# Altium schematic sheet DRV8701EVM_SCHEMATIC.SchDoc
size 431 x 279 mm; Date: Not shown in title block; ApprovedBy: Not shown in title block; CheckedBy: Not shown in title block; Author: Not shown in title block; CompanyName: Not shown in title block; Engineer: Not shown in title block; Organization: Not shown in title block; Address1: Not shown in title block; Address2: Not shown in title block; Address3: Not shown in title block; Address4: Not shown in title block; DocumentNumber: 1; Revision: Use project parameter SCH_Rev; SheetNumber: 2; SheetTotal: 2; PageSetup: Record=PageOptions|CenterHorizontal=True|CenterVertical=True|PrintScale=0.62|XCorrection=1.00|YCorrection=1.00|PrintKind=0|BorderSize=5000000|LeftOffset=0|BottomOffset=0|Orientation=2|PaperLength=1000|PaperWidth=1000|Scale=100|PaperSource=15|PrintQuality=600|MediaType=1|DitherType=10|PaperKind=Letter|PrintScaleMode=1; CurrentTime: Not shown in title block; CurrentDate: Not shown in title block; Time: Not shown in title block; DocumentFullPathAndName: Not shown in title block; DocumentName: Not shown in title block; ModifiedDate: Not shown in title block; ImagePath: Not shown in title block
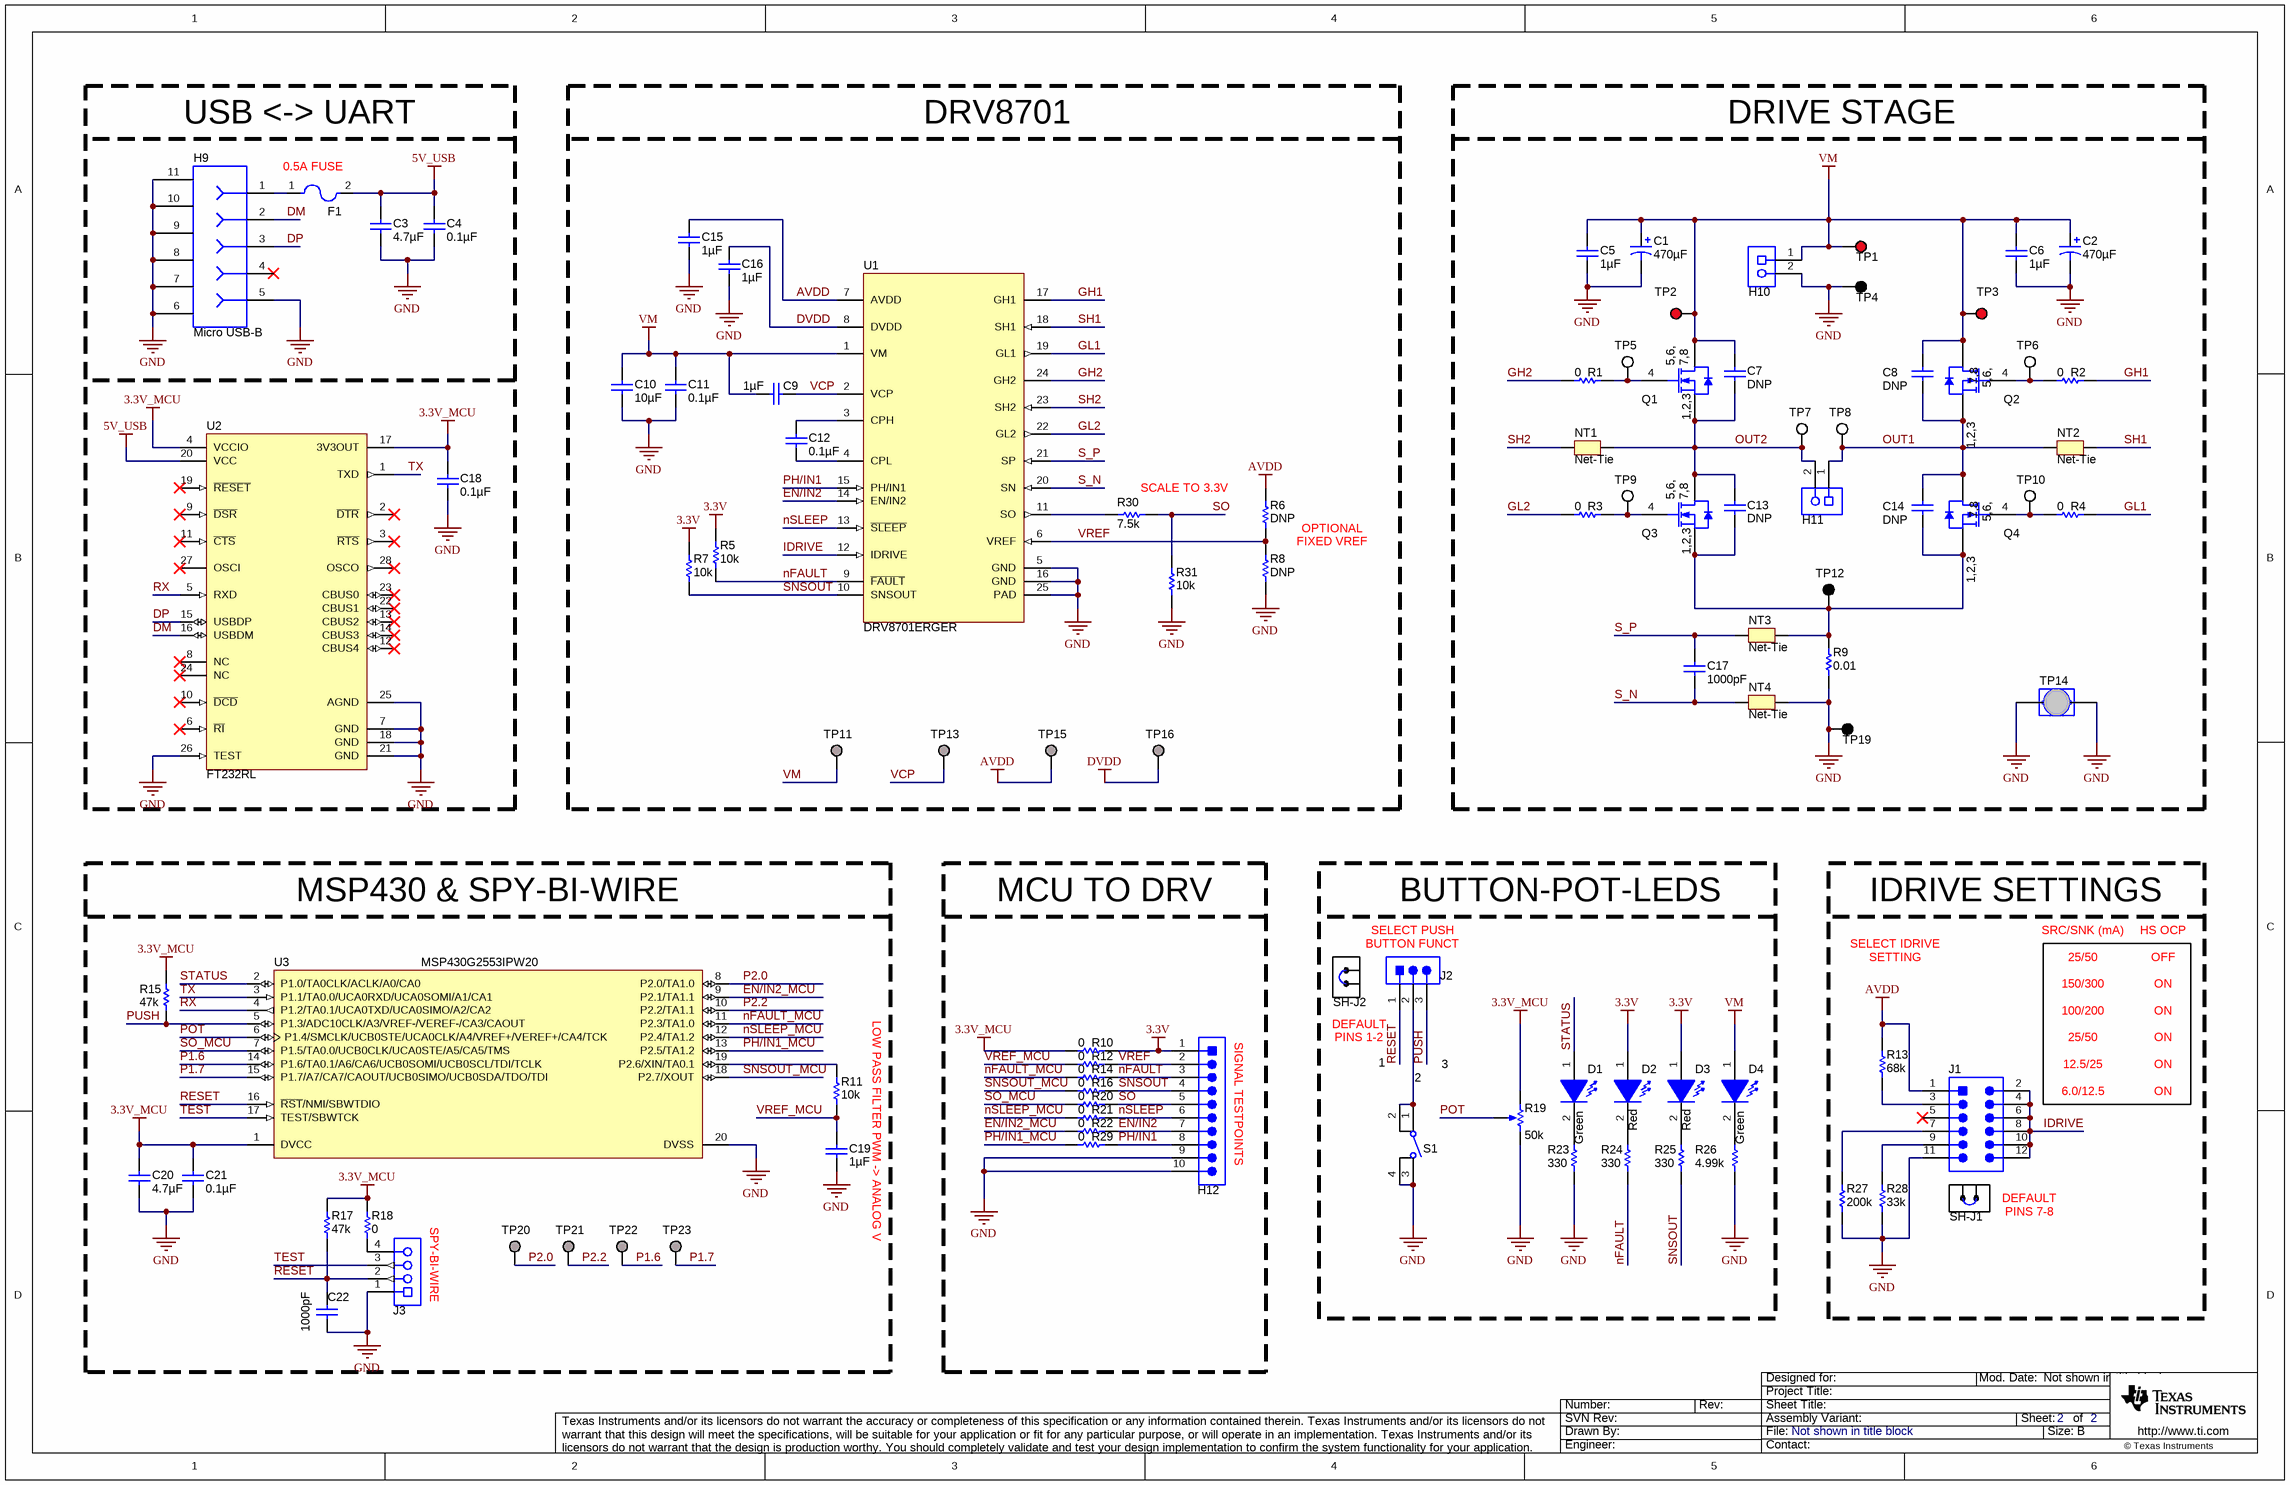
[diagram p0: DRV8701EVM_SCHEMATIC.SchDoc]

## Parts
C1  ValueDisplayed: 470µF  [M_1000x2000]  (hidden comment: ECA-1HM471)
C2  ValueDisplayed: 470µF  [M_1000x2000]  (hidden comment: ECA-1HM471)
C3  ValueDisplayed: 4.7µF  [0805L]  (hidden comment: C2012X7R1A475M)
C4  ValueDisplayed: 0.1µF  [0603L]  (hidden comment: C0603C104K8RACTU)
C5  ValueDisplayed: 1µF  [0805L]  (hidden comment: GRM21BR71H105KA12L)
C6  ValueDisplayed: 1µF  [0805L]  (hidden comment: GRM21BR71H105KA12L)
C7  DNP  [0603L]
C8  DNP  [0603L]
C9  ValueDisplayed: 1µF  [0603L]  (hidden comment: C1608X7R1C105K)
C10  ValueDisplayed: 10µF  [1210L]  (hidden comment: GRM32ER71H106KA12L)
C11  ValueDisplayed: 0.1µF  [0603L]  (hidden comment: C1608X7R1H104K)
C12  ValueDisplayed: 0.1µF  [0603L]  (hidden comment: C1608X7R1H104K)
C13  DNP  [0603L]
C14  DNP  [0603L]
C15  ValueDisplayed: 1µF  [0603L]  (hidden comment: GRM188R70J105KA01D)
C16  ValueDisplayed: 1µF  [0603L]  (hidden comment: GRM188R70J105KA01D)
C17  ValueDisplayed: 1000pF  [0402L]  (hidden comment: GRM155R71C102KA01D)
C18  ValueDisplayed: 0.1µF  [0603L]  (hidden comment: C0603C104K8RACTU)
C19  ValueDisplayed: 1µF  [0603L]  (hidden comment: GRM188R70J105KA01D)
C20  ValueDisplayed: 4.7µF  [0805L]  (hidden comment: C2012X7R1A475M)
C21  ValueDisplayed: 0.1µF  [0603L]  (hidden comment: C0603C104K8RACTU)
C22  ValueDisplayed: 1000pF  [0603L]  (hidden comment: GRM188R71C102KA01D)
D1  value Green  [LED_LTST-C171]  (hidden comment: LTST-C171GKT)
D2  value Red  [LED_LTST-C170]  (hidden comment: LTST-C170KRKT)
D3  value Red  [LED_LTST-C170]  (hidden comment: LTST-C170KRKT)
D4  value Green  [LED_LTST-C171]  (hidden comment: LTST-C171GKT)
F1  1206L050/15YR  [1206_FUSE]  (value not drawn)
H9  PackageReference: Micro USB-B  [CONN_USB_micro_ZX62-B-5PA]  (hidden comment: ZX62-B-5PA(11))
H10  691 101 710 002  [Wurth_691101710002]  (value not drawn)
H11  691 101 710 002  [Wurth_691101710002]  (value not drawn)
H12  TSW-110-07-G-S  [TSW-110-07-G-S]  (value not drawn)
J1  PEC06DAAN  [CONN_PEC06DAAN]  (value not drawn)
J2  PEC03SAAN  [CONN_PEC03SAAN]  (value not drawn)
J3  851-43-004-20-001000  [CONN_851-43-004-20-001000]  (value not drawn)
NT1  Net-Tie  [Net-Tie_10mil]  (net tie, no BOM)
NT2  Net-Tie  [Net-Tie_10mil]  (net tie, no BOM)
NT3  Net-Tie  [Net-Tie_10mil]  (net tie, no BOM)
NT4  Net-Tie  [Net-Tie_10mil]  (net tie, no BOM)
Q1  CSD18532Q5B  [TRANS_NexFET_Q5B]  (value not drawn)
Q2  CSD18532Q5B  [TRANS_NexFET_Q5B]  (value not drawn)
Q3  CSD18532Q5B  [TRANS_NexFET_Q5B]  (value not drawn)
Q4  CSD18532Q5B  [TRANS_NexFET_Q5B]  (value not drawn)
R1  value 0  [0603L]  (hidden comment: CRCW06030000Z0EA)
R2  value 0  [0603L]  (hidden comment: CRCW06030000Z0EA)
R3  value 0  [0603L]  (hidden comment: CRCW06030000Z0EA)
R4  value 0  [0603L]  (hidden comment: CRCW06030000Z0EA)
R5  value 10k  [0603L]  (hidden comment: CRCW060310K0JNEA)
R6  DNP  [0603L]
R7  value 10k  [0603L]  (hidden comment: CRCW060310K0JNEA)
R8  DNP  [0603L]
R9  value 0.01  [2512M]  (hidden comment: CRA2512-FZ-R010ELF)
R10  value 0  [0603L]  (hidden comment: CRCW06030000Z0EA)
R11  value 10k  [0603L]  (hidden comment: CRCW060310K0JNEA)
R12  value 0  [0603L]  (hidden comment: CRCW06030000Z0EA)
R13  value 68k  [0603L]  (hidden comment: CRCW060368K0JNEA)
R14  value 0  [0603L]  (hidden comment: CRCW06030000Z0EA)
R15  value 47k  [0603L]  (hidden comment: CRCW060347K0JNEA)
R16  value 0  [0603L]  (hidden comment: CRCW06030000Z0EA)
R17  value 47k  [0603L]  (hidden comment: CRCW060347K0JNEA)
R18  value 0  [0603L]  (hidden comment: CRCW06030000Z0EA)
R19  value 50k  [Bourns_3352T]  (hidden comment: 3352T-1-503LF)
R20  value 0  [0603L]  (hidden comment: CRCW06030000Z0EA)
R21  value 0  [0603L]  (hidden comment: CRCW06030000Z0EA)
R22  value 0  [0603L]  (hidden comment: CRCW06030000Z0EA)
R23  value 330  [0603L]  (hidden comment: CRCW0603330RJNEA)
R24  value 330  [0603L]  (hidden comment: CRCW0603330RJNEA)
R25  value 330  [0603L]  (hidden comment: CRCW0603330RJNEA)
R26  value 4.99k  [0603L]  (hidden comment: CRCW06034K99FKEA)
R27  value 200k  [0603L]  (hidden comment: CRCW0603200KJNEA)
R28  value 33k  [0603L]  (hidden comment: CRCW060333K0JNEA)
R29  value 0  [0603L]  (hidden comment: CRCW06030000Z0EA)
R30  ValueDisplayed: 7.5k  [0603L]  (hidden comment: CRCW06037K50JNEA)
R31  ValueDisplayed: 10k  [0603L]  (hidden comment: CRCW060310K0JNEA)
S1  4-1437565-1  [SW_FSM4JSMA]  (value not drawn)
SH-J1  969102-0000-DA  [SNT-100-BK-G]  (value not drawn)
SH-J2  969102-0000-DA  [SNT-100-BK-G]  (value not drawn)
TP1  5005  [Keystone5005]  (value not drawn)
TP2  5005  [Keystone5005]  (value not drawn)
TP3  5005  [Keystone5005]  (value not drawn)
TP4  5006  [Keystone5006]  (value not drawn)
TP5  5007  [Keystone5007]  (value not drawn)
TP6  5007  [Keystone5007]  (value not drawn)
TP7  5007  [Keystone5007]  (value not drawn)
TP8  5007  [Keystone5007]  (value not drawn)
TP9  5007  [Keystone5007]  (value not drawn)
TP10  5007  [Keystone5007]  (value not drawn)
TP11  VM  [TP_VIA_018RND008]  (value not drawn)  (no BOM)
TP12  5006  [Keystone5006]  (value not drawn)
TP13  VCP  [TP_VIA_018RND008]  (value not drawn)  (no BOM)
TP14  D3082-05  [Harwin_D3082-05]  (value not drawn)
TP15  AVDD  [TP_VIA_018RND008]  (value not drawn)  (no BOM)
TP16  DVDD  [TP_VIA_018RND008]  (value not drawn)  (no BOM)
TP19  5006  [Keystone5006]  (value not drawn)
TP20  TESTPOINT  [TP_VIA_060RND040]  (value not drawn)  (no BOM)
TP21  TESTPOINT  [TP_VIA_060RND040]  (value not drawn)  (no BOM)
TP22  TESTPOINT  [TP_VIA_060RND040]  (value not drawn)  (no BOM)
TP23  TESTPOINT  [TP_VIA_060RND040]  (value not drawn)  (no BOM)
U1  DRV8701ERGER  [RGE0024F]
U2  FT232RL  [SSOP28_N]
U3  MSP430G2553IPW20  [PW0020A_N]

## Blocks framed on the sheet
USB <-> UART: C3 C4 C18 F1 H9 U2
DRV8701: C9-C12 C15 C16 R5-R8 R30 R31 TP11 TP13 TP15 TP16 U1
DRIVE STAGE: C1 C2 C5-C8 C13 C14 C17 H10 H11 NT1-NT4 Q1-Q4 R1-R4 R9 TP1-TP10 TP12 TP14 TP19
MSP430 & SPY-BI-WIRE: C19-C22 J3 R11 R15 R17 R18 TP20-TP23 U3
MCU TO DRV: H12 R10 R12 R14 R16 R20-R22 R29
BUTTON-POT-LEDS: D1-D4 J2 R19 R23-R26 S1 SH-J2
IDRIVE SETTINGS: J1 R13 R27 R28 SH-J1

## Nets
3.3V: D2.1(A) D3.1(A) H12.1 R5.1 R7.1 R10.1
3.3V_MCU: C18.1 C20.1 C21.1 R10.2 R15.2 R17.2 R18.2 R19.1(CCW) U2.4(VCCIO) U2.17(3V3OUT) U3.1(DVCC)
5V_USB: C3.1 C4.1 F1.2 U2.20(VCC)
AVDD: C15.1 J1.1 R6.2 R13.2 TP15.1 U1.7(AVDD)
DVDD: C16.2 TP16.1 U1.8(DVDD)
GND: C1.2(-) C2.2(-) C3.2 C4.2 C5.2 C6.2 C10.2 C11.2 C15.2 C16.1 C18.2 C19.2 C20.2 C21.2 C22.2 H9.5 H9.6 H9.7 H9.8 H9.9 H9.10 H9.11 H10.2 H12.9 H12.10 J1.11 J3.1 NT4.2 R8.1 R9.1 R19.3(CW) R23.1 R26.1 R27.1 R28.1 R31.2 S1.3 S1.4 TP4.1 TP14.1 TP14.2 TP19.1 U1.5(GND) U1.16(GND) U1.25(PAD) U2.7(GND) U2.18(GND) U2.21(GND) U2.25(AGND) U2.26(TEST) U3.20(DVSS)
VM: C1.1(+) C2.1(+) C5.1 C6.1 C7.1 C8.1 C9.2 C10.1 C11.1 D4.1(A) H10.1 Q1.5(D) Q1.6(D) Q1.7(D) Q1.8(D) Q2.5(D) Q2.6(D) Q2.7(D) Q2.8(D) TP1.1 TP2.1 TP3.1 TP11.1 U1.1(VM)
DM: H9.2 U2.16(USBDM)
DP: H9.3 U2.15(USBDP)
EN/IN2: H12.7 R22.1 U1.14(EN/IN2)
EN/IN2_MCU: R22.2 U3.9(P2.1/TA1.1)
GH1: R2.1 U1.17(GH1)
GH2: R1.2 U1.24(GH2)
GL1: R4.1 U1.19(GL1)
GL2: R3.2 U1.22(GL2)
IDRIVE: J1.2 J1.4 J1.6 J1.8 J1.10 J1.12 U1.12(IDRIVE)
nFAULT: H12.3 R5.2 R14.1 R24.1 U1.9(~{FAULT})
nFAULT_MCU: R14.2 U3.11(P2.3/TA1.0)
nSLEEP: H12.6 R21.1 U1.13(~{SLEEP})
nSLEEP_MCU: R21.2 U3.12(P2.4/TA1.2)
OUT1: C8.2 C14.1 H11.1 NT2.2 Q2.1(S) Q2.2(S) Q2.3(S) Q4.5(D) Q4.6(D) Q4.7(D) Q4.8(D) TP8.1
OUT2: C7.2 C13.1 H11.2 NT1.2 Q1.1(S) Q1.2(S) Q1.3(S) Q3.5(D) Q3.6(D) Q3.7(D) Q3.8(D) TP7.1
P1.6: TP22.1 U3.14(P1.6/TA0.1/A6/CA6/UCB0SOMI/UCB0SCL/TDI/TCLK)
P1.7: TP23.1 U3.15(P1.7/A7/CA7/CAOUT/UCB0SIMO/UCB0SDA/TDO/TDI)
P2.0: TP20.1 U3.8(P2.0/TA1.0)
P2.2: TP21.1 U3.10(P2.2/TA1.1)
PH/IN1: H12.8 R29.1 U1.15(PH/IN1)
PH/IN1_MCU: R29.2 U3.13(P2.5/TA1.2)
POT: R19.2(WIPER) U3.6(P1.4/SMCLK/UCB0STE/UCA0CLK/A4/VREF+/VEREF+/CA4/TCK)
PUSH: J2.3 R15.1 U3.5(P1.3/ADC10CLK/A3/VREF-/VEREF-/CA3/CAOUT)
RESET: C22.1 J2.1 J3.2 R17.1 U3.16(~{RST}/NMI/SBWTDIO)
RX: U2.5(RXD) U3.4(P1.2/TA0.1/UCA0TXD/UCA0SIMO/A2/CA2)
S_N: C17.2 NT4.1 U1.20(SN)
S_P: C17.1 NT3.2 U1.21(SP)
SH1: NT2.1 U1.18(SH1)
SH2: NT1.1 U1.23(SH2)
SNSOUT: H12.4 R7.2 R16.1 R25.1 U1.10(SNSOUT)
SNSOUT_MCU: R16.2 U3.18(P2.7/XOUT)
SO: H12.5 R20.1 R30.1 R31.1
SO_MCU: R20.2 U3.7(P1.5/TA0.0/UCB0CLK/UCA0STE/A5/CA5/TMS)
STATUS: D1.1(A) U3.2(P1.0/TA0CLK/ACLK/A0/CA0)
TEST: J3.3 U3.17(TEST/SBWTCK)
TX: U2.1(TXD) U3.3(P1.1/TA0.0/UCA0RXD/UCA0SOMI/A1/CA1)
VCP: C9.1 TP13.1 U1.2(VCP)
VREF: H12.2 R6.1 R8.2 R12.1 U1.6(VREF)
VREF_MCU: C19.1 R11.2 R12.2
NetC12_1: C12.1 U1.3(CPH)
NetC12_2: C12.2 U1.4(CPL)
NetC13_2: C13.2 C14.2 NT3.1 Q3.1(S) Q3.2(S) Q3.3(S) Q4.1(S) Q4.2(S) Q4.3(S) R9.2 TP12.1
NetD1_2: D1.2(K) R23.2
NetD2_2: D2.2(K) R24.2
NetD3_2: D3.2(K) R25.2
NetD4_2: D4.2(K) R26.2
NetF1_1: F1.1 H9.1
NetJ1_3: J1.3 R13.1
NetJ1_7: J1.7 R27.2
NetJ1_9: J1.9 R28.2
NetJ2_2: J2.2 S1.1 S1.2
NetJ3_4: J3.4 R18.1
NetQ1_4: Q1.4(G) R1.1 TP5.1
NetQ2_4: Q2.4(G) R2.2 TP6.1
NetQ3_4: Q3.4(G) R3.1 TP9.1
NetQ4_4: Q4.4(G) R4.2 TP10.1
NetR11_1: R11.1 U3.19(P2.6/XIN/TA0.1)
NetR30_2: R30.2 U1.11(SO)

Not connected (* = marked no-connect by the designer): H9 4*; J1 5*; U2 2(~{DTR})* 3(~{RTS})* 6(~{RI})* 8(NC)* 9(~{DSR})* 10(~{DCD})* 11(~{CTS})* 12(CBUS4)* 13(CBUS2)* 14(CBUS3)* 19(~{RESET})* 22(CBUS1)* 23(CBUS0)* 24(NC)* 27(OSCI)* 28(OSCO)*

## Notes on the sheet
- (near F1) 0.5A FUSE
- (near R30) SCALE TO 3.3V
- OPTIONAL
- FIXED VREF
- SELECT PUSH
- BUTTON FUNCT
- SETTING
- SELECT IDRIVE
- SRC/SNK (mA)
- 25/50
- HS OCP
- OFF
- DEFAULT
- PINS 1-2
- 100/200
- 150/300
- ON
- (near H12) SIGNAL TESTPOINTS
- 1
- (near S1) 2
- 3
- 6.0/12.5
- 12.5/25
- LOW PASS FILTER PWM -> ANALOG V
- PINS 7-8
- (near J3) SPY-BI-WIRE
- Drawn By:
- SVN Rev:
- Number:
- Rev:
- Sheet Title:
- File:
- Project Title:
- Designed for:
- Assembly Variant:
- Mod. Date:
- Sheet:
- Size:
- of
- B
- http://www.ti.com
- Texas Instruments and/or its licensors do not warrant the accuracy or completeness of this specification or any information contained therein. Texas Instruments and/or its licensors do not warrant that this design will meet the specifications, will be suitable for your application or fit for any particular purpose, or will operate in an implementation. Texas Instruments and/or its licensors do not warrant that the design is production worthy. You should completely validate and test your design implementation to confirm the system functionality for your application.
- Engineer:
- Contact:
- © Texas Instruments
- (in symbol CSD18532Q5B) 5,6,; 7,8; 1,2,3

## Library data of the parts
C1 C2 = ECA-1HM471: CAP, AL, 470 µF, 50 V, +/- 20%,  ohm, TH; Manufacturer: Panasonic; Polarized: Y; CompType: Capacitor; Value: 470uF; U/M: EA; Cap_F: 0.00047; Tolerance_%: 20; Value1: Unknown; VDC_V: 50; Value2: 50V; IRMS_A: 0.65; TaMin_C: -40; TaMax_C: 85; Cap_Case: 10x20mm; SymbolVersion: 2008-07-09; PartNumber: ECA-1HM471; PackageReference: D10xL20mm; RoHS: Y; MountType: TH; Technology: AL; Series: M; Publisher: Texas Instruments; LatestRevisionDate: 2015-02-10; ComponentLink1Description: Datasheet link; ComponentLink1URL: http://industrial.panasonic.com/www-data/pdf/ABA0000/ABA0000CE12.pdf; Supplier 1: Digi-Key; Supplier Part Number 1: P5185-ND; Supplier 2: Mouser; Supplier Part Number 2: 667-ECA-1HM471; Supplier 3: Farnell; Supplier Part Number 3: 9693815
C3 C20 = C2012X7R1A475M: CAP, CERM, 4.7uF, 10V, +/-20%, X7R, 0805; Manufacturer: TDK; Polarized: N; CompType: Capacitor; U/M: EA; Cap_F: 0.0000047; Tolerance_%: 20; Value1: Unknown; VDC_V: 10; TaMin_C: -55; TaMax_C: 125; Cap_Case: 0805; SymbolVersion: 2008-07-09; Value: 4.7uF; PartNumber: C2012X7R1A475M; PackageReference: 0805; RoHS: Y; Value2: 10V; MountType: SMT; Technology: Ceramic; TempCo: X7R; Published: 2008-06-19; Publisher: Texas Instruments; LatestRevisionDate: 2014-05-28; ComponentLink1Description: Datasheet link; ComponentLink1URL: http://www.tdk.co.jp/tefe02/e412_c.pdf; Supplier 1: Digi-Key; Supplier Part Number 1: 445-1605-1-ND; Supplier 2: Farnell; Supplier Part Number 2: 1844277
C4 C18 C21 = C0603C104K8RACTU: CAP, CERM, 0.1uF, 10V, +/-10%, X7R, 0603; Manufacturer: Kemet; Polarized: N; CompType: Capacitor; U/M: EA; Cap_F: 0.0000001; Tolerance_%: 10; Value1: Unknown; TaMin_C: -55; TaMax_C: 125; Cap_Case: 0603; SymbolVersion: 2008-07-09; Value: 0.1uF; PartNumber: C0603C104K8RACTU; PackageReference: 0603; RoHS: Y; VDC_V: 10; Value2: 10V; MountType: SMT; Technology: Ceramic; TempCo: X7R; Published: 2008-06-19; Publisher: Texas Instruments; LatestRevisionDate: 2014-05-28; ComponentLink1Description: Datasheet link; ComponentLink1URL: http://www.kemet.com/kemet/web/homepage/kechome.nsf/vapubfiles/F3102_Y5V.pdf/$file/F3102_Y5V.pdf; Supplier 1: Digi-Key; Supplier Part Number 1: 399-1095-1-ND; Supplier 2: Mouser; Supplier Part Number 2: 80-C0603C104K8R; Supplier 3: Farnell; Supplier Part Number 3: 1640032
C5 C6 = GRM21BR71H105KA12L: CAP, CERM, 1uF, 50V, +/-10%, X7R, 0805; Manufacturer: MuRata; Polarized: N; CompType: Capacitor; U/M: EA; Cap_F: 0.000001; Tolerance_%: 10; Value1: Unknown; VDC_V: 50; TaMin_C: -55; TaMax_C: 125; Cap_Case: 0805; SymbolVersion: 2008-07-09; Value: 1uF; PartNumber: GRM21BR71H105KA12L; PackageReference: 0805; RoHS: Y; Value2: 50V; MountType: SMT; Technology: Ceramic; TempCo: X7R; Published: 2008-06-19; Publisher: Texas Instruments; LatestRevisionDate: 2013-09-06; ComponentLink1Description: Datasheet link; ComponentLink1URL: http://search.murata.co.jp/Ceramy/PnsearchViewAction.do?HnOFG=ON&HnNFG=ON&SEL_CNT=50&sLang=en&sKey=GRM21BR71H105KA12L&x=9&y=9&search=startwith; Supplier 1: Digi-Key; Supplier Part Number 1: 490-4736-1-ND; Supplier 2: Mouser; Supplier Part Number 2: 81-GRM21BR71H105KA2L; Supplier 3: Farnell; Supplier Part Number 3: 1735541
C7 C8 C13 C14 = C1608X7R1H103K: CAP, CERM, 0.01uF, 50V, +/-10%, X7R, 0603; Polarized: N; CompType: Capacitor; U/M: EA; Cap_F: 0.00000001; Cap_Case: 0603; SymbolVersion: 2008-07-09; Value: DNP; PartNumber: DNP; ValueDisplayed: DNP; Manufacturer: DNP; PackageReference: 0603; RoHS: Y; MountType: SMT; Technology: Ceramic; Published: 2008-06-19; Publisher: Texas Instruments; LatestRevisionDate: 2014-05-28; ComponentLink1Description: Datasheet link
C9 = C1608X7R1C105K: CAP, CERM, 1uF, 16V, +/-10%, X7R, 0603; Manufacturer: TDK; Polarized: N; CompType: Capacitor; U/M: EA; Cap_F: 0.000001; Tolerance_%: 10; ESR_Ohm: 0.0057; Value1: 0.0057 ohm; VDC_V: 16; TaMin_C: -55; TaMax_C: 125; Cap_Case: 0603; SymbolVersion: 2008-07-09; Value: 1uF; PartNumber: C1608X7R1C105K; PackageReference: 0603; RoHS: Y; Value2: 16V; MountType: SMT; Technology: Ceramic; TempCo: X7R; Published: 2008-06-19; Publisher: Texas Instruments; LatestRevisionDate: 2014-05-28; ComponentLink1Description: Datasheet link; ComponentLink1URL: http://www.tdk.co.jp/tefe02/e412_c.pdf; Supplier 1: Digi-Key; Supplier Part Number 1: 445-1604-1-ND; Supplier 2: Farnell; Supplier Part Number 2: 1907343
C10 = GRM32ER71H106KA12L: CAP, CERM, 10uF, 50V, +/-10%, X7R, 1210; Manufacturer: MuRata; Polarized: N; CompType: Capacitor; U/M: EA; Cap_F: 0.00001; Tolerance_%: 10; Value1: Unknown; VDC_V: 50; TaMin_C: -55; TaMax_C: 125; Cap_Case: 1210; SymbolVersion: 2008-07-09; Value: 10uF; PartNumber: GRM32ER71H106KA12L; PackageReference: 1210; RoHS: Y; Value2: 50V; MountType: SMT; Technology: Ceramic; TempCo: X7R; Published: 2008-06-19; Publisher: Texas Instruments; LatestRevisionDate: 2014-05-28; ComponentLink1Description: Datasheet link; ComponentLink1URL: http://www.murata.com/products/catalog/pdf/c02e.pdf; Supplier 1: Digi-Key; Supplier Part Number 1: 490-6544-1-ND; Supplier 2: Mouser; Supplier Part Number 2: 81-GRM32ER71H106KA2L
C11 C12 = C1608X7R1H104K: CAP, CERM, 0.1uF, 50V, +/-10%, X7R, 0603; Manufacturer: TDK; Polarized: N; CompType: Capacitor; U/M: EA; Cap_F: 0.0000001; Tolerance_%: 10; ESR_Ohm: 0.017; Value1: 0.017 ohm; VDC_V: 50; TaMin_C: -55; TaMax_C: 125; Cap_Case: 0603; SymbolVersion: 2008-07-09; Value: 0.1uF; PartNumber: C1608X7R1H104K; PackageReference: 0603; RoHS: Y; Value2: 50V; MountType: SMT; Technology: Ceramic; TempCo: X7R; Published: 2008-06-19; Publisher: Texas Instruments; LatestRevisionDate: 2014-05-28; ComponentLink1Description: Datasheet link; ComponentLink1URL: http://www.tdk.co.jp/tefe02/e412_c.pdf; Supplier 1: Digi-Key; Supplier Part Number 1: 445-1314-1-ND; Supplier 2: Farnell; Supplier Part Number 2: 1118182
C15 C16 C19 = GRM188R70J105KA01D: CAP, CERM, 1uF, 6.3V, +/-10%, X7R, 0603; Manufacturer: MuRata; Polarized: N; CompType: Capacitor; U/M: EA; Cap_F: 0.000001; Tolerance_%: 10; Value1: Unknown; VDC_V: 6.3; TaMin_C: -55; TaMax_C: 125; Cap_Case: 0603; SymbolVersion: 2008-07-09; Value: 1uF; PartNumber: GRM188R70J105KA01D; PackageReference: 0603; RoHS: Y; Value2: 6.3V; MountType: SMT; Technology: Ceramic; TempCo: X7R; Published: 2008-06-19; Publisher: Texas Instruments; LatestRevisionDate: 2014-05-28; ComponentLink1Description: Datasheet link; ComponentLink1URL: http://search.murata.co.jp/Ceramy/PnsearchViewAction.do?HnOFG=ON&HnNFG=ON&SEL_CNT=50&sLang=en&sKey=GRM188R70J105KA01D&x=9&y=9&search=startwith; Supplier 1: Digi-Key; Supplier Part Number 1: 490-3898-1-ND; Supplier 2: Mouser; Supplier Part Number 2: 81-GRM188R70J105KA01; Supplier 3: Farnell; Supplier Part Number 3: 1845765
C17 = GRM155R71C102KA01D: CAP, CERM, 1000pF, 16V, +/-10%, X7R, 0402; Manufacturer: MuRata; Polarized: N; CompType: Capacitor; U/M: EA; Cap_F: 0.000000001; Tolerance_%: 10; Value1: Unknown; VDC_V: 16; TaMin_C: -55; TaMax_C: 125; Cap_Case: 0402; SymbolVersion: 2008-07-09; Value: 1000pF; PartNumber: GRM155R71C102KA01D; PackageReference: 0402; RoHS: Y; Value2: 16V; MountType: SMT; Technology: Ceramic; TempCo: X7R; Published: 2008-06-19; Publisher: Texas Instruments; LatestRevisionDate: 2013-12-18; ComponentLink1Description: Datasheet link; ComponentLink1URL: http://search.murata.co.jp/Ceramy/PnsearchViewAction.do?HnOFG=ON&HnNFG=ON&SEL_CNT=50&sLang=en&sKey=GRM155R71C102KA01D&x=9&y=9&search=startwith; Supplier 1: Digi-Key; Supplier Part Number 1: GRM155R71C102KA01D-ND; Supplier 2: Mouser; Supplier Part Number 2: 81-GRM155R71C102KA1D
C22 = GRM188R71C102KA01D: CAP, CERM, 1000pF, 16V, +/-10%, X7R, 0603; Manufacturer: MuRata; Polarized: N; CompType: Capacitor; U/M: EA; Cap_F: 0.000000001; Tolerance_%: 10; Value1: Unknown; VDC_V: 16; TaMin_C: -55; TaMax_C: 125; Cap_Case: 0603; SymbolVersion: 2008-07-09; Value: 1000pF; PartNumber: GRM188R71C102KA01D; PackageReference: 0603; RoHS: Y; Value2: 16V; MountType: SMT; Technology: Ceramic; TempCo: X7R; Published: 2008-06-19; Publisher: Texas Instruments; LatestRevisionDate: 2014-05-28; ComponentLink1Description: Datasheet link; ComponentLink1URL: http://search.murata.co.jp/Ceramy/PnsearchViewAction.do?HnOFG=ON&HnNFG=ON&SEL_CNT=50&sLang=en&sKey=GRM188R71C102KA01D&x=9&y=9&search=startwith; Supplier 1: Digi-Key; Supplier Part Number 1: GRM188R71C102KA01D-ND; Supplier 2: Mouser; Supplier Part Number 2: 81-GRM188R71C102KA1D
D1 D4 = LTST-C171GKT: LED, Green, SMD; Manufacturer: Lite-On; Type: AlInGaP; Vf_V: 2.1; Value2: 2.1V; Io_A: 20; Value1: W; U/M: EA; CompType: LED; PartNumber: LTST-C171GKT; SymbolVersion: 2008-12-08; MountType: SMT; RoHS: Y; PackageReference: LED_0805; Color: green; Published: 2008-07-11; Publisher: Texas Instruments; ComponentLink1URL: https://sps06.itg.ti.com/sites/KMS/crossdivteams/altium/docs/ComponentDatasheets/LTST-C171GKT.pdf; ComponentLink1Description: Datasheet link; LatestRevisionDate: 2013-09-07; Supplier 1: Digi-Key; Supplier Part Number 1: 160-1423-1-ND; Supplier 2: Mouser; Supplier Part Number 2: 859-LTST-C171GKT
D2 D3 = LTST-C170KRKT: LED, Red, SMD; Manufacturer: Lite-On; Type: AlInGaP; Vf_V: 2; Value2: 2V; Io_A: 20; Value1: W; U/M: EA; CompType: LED; PartNumber: LTST-C170KRKT; SymbolVersion: 2008-12-08; MountType: SMT; RoHS: Y; PackageReference: LED_0805; Color: red; Published: 2008-07-11; Publisher: Texas Instruments; ComponentLink1URL: http://optoelectronics.liteon.com/en-us/api/DwonloadFileHandler.ashx?txtSpecNo=DS-22-99-0150&txtPartNo=LTST-C170KRKT; ComponentLink1Description: Datasheet link; LatestRevisionDate: 2013-09-07; Supplier 1: Digi-Key; Supplier Part Number 1: 160-1415-1-ND; Supplier 2: Mouser; Supplier Part Number 2: 859-LTST-C170KRKT
F1 = FUSE_1206L_SERIES: Fuse, Poly Resetable PTC, 0.5A; Manufacturer: Littelfuse; Area: 19800; PackageReference: 1206; PartNumber: 1206L050/15YR; SymbolVersion: 11/19/2010 10:03:57; ComponentLink1URL: \\vette02\pmp_pcb\pcad_pdf's\Littelfuse_1206l.pdf; Value: 1206L050/15YR; ComponentLink1Description: AEO Datasheet Link
H9 = ZX62-B-5PA(11): Connector, micro USB Type B, Receptacle, R/A, SMD; Manufacturer: Hirose Electric Co. Ltd.; SymbolCreator: a0411947; U/M: EA; SymbolVersion: 2013-04-05; PartNumber: ZX62-B-5PA(11); CompType: Receptacle; RoHS: Y; MountType: SMT; ComponentLink1Description: Datasheet Link; ComponentLink1URL: http://www.hirose.co.jp/cataloge_hp/e24200011.pdf; Publisher: Texas Instruments; LatestRevisionDate: 2014-02-24; Supplier 1: Digi-Key; Supplier Part Number 1: H11634CT-ND; Supplier 2: Mouser; Supplier Part Number 2: 798-ZX62-B-5PA11; Supplier 3: Farnell; Supplier Part Number 3: 1645325
H10 H11 = 691 101 710 002: Terminal Block, 5 mm, 2x1, Tin, TH; Manufacturer: Wurth Elektronik eiSos; SymbolCreator: a0412235; U/M: EA; SymbolVersion: 2013-09-04; PartNumber: 691 101 710 002; PackageReference: Terminal Block, 5 mm, 2x1, TH; CompType: Terminal Block; RoHS: Y; MountType: TH; ComponentLink1Description: Datasheet Link; ComponentLink1URL: http://katalog.we-online.de/em/datasheet/6911017100xx.pdf; Publisher: Texas Instruments; LatestRevisionDate: 2015-02-03; Supplier 1: Digi-Key; Supplier Part Number 1: 732-2026-ND; Supplier 2: Mouser; Supplier Part Number 2: 710-691101710002
H12 = TSW-110-07-G-S: Header, 100mil, 10x1, Gold, TH; Manufacturer: Samtec; SymbolCreator: a0412235; U/M: EA; SymbolVersion: 2013-12-22; PartNumber: TSW-110-07-G-S; PackageReference: 10x1 Header; ClassName: Header; CompType: Header; RoHS: Y; MountType: TH; ComponentLink1Description: Datasheet Link; ComponentLink1URL: http://samtec.com/ftppub/pdf/TSW_TH.PDF; Publisher: Texas Instruments; LatestRevisionDate: 2015-02-06; Supplier 1: Digi-Key; Supplier Part Number 1: SAM1029-10-ND
J1 = PEC06DAAN: Header, 100mil, 6x2, Tin, TH; Manufacturer: Sullins Connector Solutions; SymbolCreator: a0412235; U/M: EA; SymbolVersion: 2013-12-22; PartNumber: PEC06DAAN; PackageReference: Header, 6x2, 100mil, Tin; ClassName: Header; CompType: Header; RoHS: Y; MountType: TH; ComponentLink1Description: Datasheet Link; ComponentLink1URL: http://www.sullinscorp.com/catalogs/97_Page78-79_HEADER_.100_2.54mm_MALE_BREAKAWAY.pdf; Publisher: Texas Instruments; LatestRevisionDate: 2015-02-02; Supplier 1: Digi-Key; Supplier Part Number 1: S2012E-06-ND
J2 = PEC03SAAN: Header, 100mil, 3x1, Tin, TH; Manufacturer: Sullins Connector Solutions; SymbolCreator: a0799628; U/M: EA; SymbolVersion: 2013-03-28; PartNumber: PEC03SAAN; PackageReference: Header, 3 PIN, 100mil, Tin; ClassName: Header; CompType: Header; RoHS: Y; MountType: TH; ComponentLink1Description: Datasheet Link; ComponentLink1URL: http://www.sullinscorp.com/catalogs/97_Page78-79_HEADER_.100_2.54mm_MALE_BREAKAWAY.pdf; Publisher: Texas Instruments; LatestRevisionDate: 2015-02-02; Supplier 1: Digi-Key; Supplier Part Number 1: S1012E-03-ND
J3 = 851-43-004-20-001000: SOCKET .050" GRID SIP 4 POS R/A, TH; Manufacturer: Mill-Max; SymbolCreator: a0411947; CompType: Header; U/M: EA; SymbolVersion: 2013-08-30; PartNumber: 851-43-004-20-001000; PackageReference: R/A 4x1 receptacle; RoHS: Y; MountType: TH; ComponentLink1Description: Datasheet Link; ComponentLink1URL: http://www.mill-max.com/images/products/pdf/metric/067M.pdf; Publisher: Texas Instruments; LatestRevisionDate: 2014-05-28; Supplier 1: Digi-Key; Supplier Part Number 1: ED90474-ND
NT1-NT4 = Net-Tie: Single point connection between nets.; SymbolCreator: codlsc; SymbolVersion: 2009-07-01; MountType: SMT; Publisher: Texas Instruments; LatestRevisionDate: 2013-09-07; LatestRevisionNote: Added Alternate PartNumber and Alternate Manufacturer parameters to appropriate components.
Q1-Q4 = CSD18532Q5B: MOSFET, N-CH, 60V, 172A, SON 5x6mm; Manufacturer: Texas Instruments; Alternate Manufacturer: None; U/M: EA; ChType: N; VdsMax_V: 60; Value1: 3.3 ohm; Rdson45_Ohm: 3.3; Value2: 27 nC; QgTyp_nC: 27; Vgs_V: 1.6; IdsMax_A: 172; SymbolVersion: 2008-07-09; CompType: MOSFET; PartNumber: CSD18532Q5B; PackageReference: SON 5x6mm; Value: 60V; RoHS: Y; MountType: SMT; Published: 2008-06-19; Publisher: Texas Instruments; LatestRevisionDate: 2014-05-23; LatestRevisionNote: Added parts.; ComponentLink1Description: Datasheet link; ComponentLink1URL: http://www.ti.com/lit/gpn/csd18532q5b; Supplier 1: Digi-Key; Supplier Part Number 1: 296-35628-1-ND; Supplier 2: Mouser; Supplier Part Number 2: 595-CSD18532Q5B; Supplier 3: Newark; Supplier Part Number 3: 63W5308
R1-R4 R10 R12 R14 R16 R18 R20-R22 R29 = CRCW06030000Z0EA: RES, 0 ohm, 5%, 0.1W, 0603; Manufacturer: Vishay-Dale; CompType: Resistor; Value_Code: 0000; Tolerance_%: 5; Power_W: 0.1; VDC_V: 75; TempCo: 200 ppm/C; EIA_Code: E24; U/M: EA; SymbolVersion: 2009-05-29; PartNumber: CRCW06030000Z0EA; PackageReference: 0603; RoHS: Y; Res_ohm: 0; Value1: 5%; Value2: 0.1W; MountType: SMT; Technology: Thick Film; Published: 2008-06-26; Publisher: Texas Instruments; LatestRevisionDate: 2014-05-20; ComponentLink1Description: Datasheet link; ComponentLink1URL: http://www.vishay.com/docs/20035/dcrcwe3.pdf; Supplier 1: Digi-Key; Supplier Part Number 1: 541-0.0GCT-ND; Supplier 2: Mouser; Supplier Part Number 2: 71-CRCW0603-0-E3; Supplier 3: Farnell; Supplier Part Number 3: 1469739
R5 R7 R11 = CRCW060310K0JNEA: RES, 10k ohm, 5%, 0.1W, 0603; Manufacturer: Vishay-Dale; CompType: Resistor; Res_ohm: 10000; Value_Code: 10k0; Tolerance_%: 5; Power_W: 0.1; VDC_V: 75; TempCo: 200 ppm/C; EIA_Code: E24; U/M: EA; SymbolVersion: 2009-05-29; PartNumber: CRCW060310K0JNEA; PackageReference: 0603; RoHS: Y; Value1: 5%; Value2: 0.1W; MountType: SMT; Technology: Thick Film; Published: 2008-06-26; Publisher: Texas Instruments; LatestRevisionDate: 2013-08-23; ComponentLink1Description: Datasheet link; ComponentLink1URL: http://www.vishay.com/docs/20035/dcrcwe3.pdf; Supplier 1: Digi-Key; Supplier Part Number 1: 541-10KGCT-ND; Supplier 2: Farnell; Supplier Part Number 2: 1562240; Supplier 3: Newark; Supplier Part Number 3: 52K8066
R6 R8 = CRCW06030000Z0EA: RES, 0 ohm, 5%, 0.1W, 0603; CompType: Resistor; Power_W: 0.1; EIA_Code: E24; U/M: EA; SymbolVersion: 2009-05-29; Value: DNP; PartNumber: DNP; Manufacturer: DNP; PackageReference: 0603; RoHS: Y; Res_ohm: DNP; MountType: SMT; Published: 2008-06-26; Publisher: Texas Instruments; LatestRevisionDate: 2013-08-23
R9 = CRA2512-FZ-R010ELF: RES, 0.01 ohm, 1%, 3W, 2512; Manufacturer: Bourns; CompType: Resistor; Value_Code: R010; Tolerance_%: 1; Power_W: 3; TempCo: 75 ppm/C; EIA_Code: E96; U/M: EA; SymbolVersion: 2009-05-29; PartNumber: CRA2512-FZ-R010ELF; PackageReference: 2512; RoHS: Y; Res_ohm: 0.01; Value1: 1%; Value2: 3W; MountType: SMT; Technology: Metal Film; Published: 2008-06-26; Publisher: Texas Instruments; LatestRevisionDate: 2014-05-22; ComponentLink1Description: Datasheet link; ComponentLink1URL: http://www.bourns.com/data/global/pdfs/CRA.pdf; Supplier 1: Digi-Key; Supplier Part Number 1: CRA2512-FZ-R010ELFCT-ND; Supplier 2: Mouser; Supplier Part Number 2: 652-CRA2512FZR010ELF; Supplier 3: Farnell; Supplier Part Number 3: 1435947
R13 = CRCW060368K0JNEA: RES, 68k ohm, 5%, 0.1W, 0603; Manufacturer: Vishay-Dale; CompType: Resistor; Res_ohm: 68000; Value_Code: 68k0; Tolerance_%: 5; Power_W: 0.1; VDC_V: 75; TempCo: 200 ppm/C; EIA_Code: E24; U/M: EA; SymbolVersion: 2009-05-29; PartNumber: CRCW060368K0JNEA; PackageReference: 0603; RoHS: Y; Value1: 5%; Value2: 0.1W; MountType: SMT; Technology: Thick Film; Published: 2008-06-26; Publisher: Texas Instruments; LatestRevisionDate: 2014-05-20; ComponentLink1Description: Datasheet link; ComponentLink1URL: http://www.vishay.com/docs/20035/dcrcwe3.pdf; Supplier 1: Digi-Key; Supplier Part Number 1: 541-68KGCT-ND; Supplier 2: Farnell; Supplier Part Number 2: 1555061; Supplier 3: Newark; Supplier Part Number 3: 72M6847
R15 R17 = CRCW060347K0JNEA: RES, 47k ohm, 5%, 0.1W, 0603; Manufacturer: Vishay-Dale; CompType: Resistor; Res_ohm: 47000; Value_Code: 47k0; Tolerance_%: 5; Power_W: 0.1; VDC_V: 75; TempCo: 200 ppm/C; EIA_Code: E24; U/M: EA; SymbolVersion: 2009-05-29; PartNumber: CRCW060347K0JNEA; PackageReference: 0603; RoHS: Y; Value1: 5%; Value2: 0.1W; MountType: SMT; Technology: Thick Film; Published: 2008-06-26; Publisher: Texas Instruments; LatestRevisionDate: 2014-05-20; ComponentLink1Description: Datasheet link; ComponentLink1URL: http://www.vishay.com/docs/20035/dcrcwe3.pdf; Supplier 1: Digi-Key; Supplier Part Number 1: 541-47KGCT-ND; Supplier 2: Mouser; Supplier Part Number 2: 71-CRCW060347K0JNEA; Supplier 3: Farnell; Supplier Part Number 3: 1652881
R19 = 3352T-1-503LF: Trimming Potentiometer, 50K, 0.5W, TH; Manufacturer: Bourns; Sim Note: Enter the Resistance value and the set point into parameter fields.; SymbolCreator: a0412235; CompType: Trimmer; SymbolVersion: 2012-12-27; PartNumber: 3352T-1-503LF; MountType: TH; ComponentLink1Description: Datasheet Link; ComponentLink1URL: http://www.bourns.com/data/global/PDFs/3352.pdf; RoHS: Y; PackageReference: 9.53x8.89mm; Publisher: Texas Instruments; LatestRevisionDate: 2015-02-10; Supplier 1: Digi-Key; Supplier Part Number 1: 3352T-503LF-ND; Supplier 2: Mouser; Supplier Part Number 2: 652-3352T-1-503LF; Supplier 3: Farnell; Supplier Part Number 3: 1106991
R23-R25 = CRCW0603330RJNEA: RES, 330 ohm, 5%, 0.1W, 0603; Manufacturer: Vishay-Dale; CompType: Resistor; Value_Code: 330R; Tolerance_%: 5; Power_W: 0.1; VDC_V: 75; TempCo: 200 ppm/C; EIA_Code: E24; U/M: EA; SymbolVersion: 2009-05-29; PartNumber: CRCW0603330RJNEA; PackageReference: 0603; RoHS: Y; Res_ohm: 330; Value1: 5%; Value2: 0.1W; MountType: SMT; Technology: Thick Film; Published: 2008-06-26; Publisher: Texas Instruments; LatestRevisionDate: 2013-10-22; ComponentLink1Description: Datasheet link; ComponentLink1URL: http://www.vishay.com/docs/20035/dcrcwe3.pdf; Supplier 1: Digi-Key; Supplier Part Number 1: 541-330GCT-ND; Supplier 2: Mouser; Supplier Part Number 2: 71-CRCW0603J-330-E3; Supplier 3: Farnell; Supplier Part Number 3: 1692522
R26 = CRCW06034K99FKEA: RES, 4.99k ohm, 1%, 0.1W, 0603; Manufacturer: Vishay-Dale; CompType: Resistor; Res_ohm: 4990; Value_Code: 4k99; Tolerance_%: 1; Power_W: 0.1; VDC_V: 75; TempCo: 100 ppm/C; EIA_Code: E96; U/M: EA; SymbolVersion: 2009-05-29; PartNumber: CRCW06034K99FKEA; PackageReference: 0603; RoHS: Y; Value1: 1%; Value2: 0.1W; MountType: SMT; Technology: Thick Film; Published: 2008-06-26; Publisher: Texas Instruments; LatestRevisionDate: 2013-10-22; ComponentLink1Description: Datasheet link; ComponentLink1URL: http://www.vishay.com/docs/20035/dcrcwe3.pdf; Supplier 1: Digi-Key; Supplier Part Number 1: 541-4.99KHCT-ND; Supplier 2: Mouser; Supplier Part Number 2: 71-CRCW0603-4.99K-E3; Supplier 3: Farnell; Supplier Part Number 3: 1652885
R27 = CRCW0603200KJNEA: RES, 200k ohm, 5%, 0.1W, 0603; Manufacturer: Vishay-Dale; CompType: Resistor; Res_ohm: 200000; Tolerance_%: 5; Power_W: 0.1; VDC_V: 75; TempCo: 200 ppm/C; EIA_Code: E24; U/M: EA; SymbolVersion: 2009-05-29; PartNumber: CRCW0603200KJNEA; PackageReference: 0603; RoHS: Y; Value_Code: 200k; Value1: 5%; Value2: 0.1W; MountType: SMT; Technology: Thick Film; Published: 2008-06-26; Publisher: Texas Instruments; LatestRevisionDate: 2014-05-20; ComponentLink1Description: Datasheet link; ComponentLink1URL: http://www.vishay.com/docs/20035/dcrcwe3.pdf; Supplier 1: Digi-Key; Supplier Part Number 1: 541-200KGCT-ND; Supplier 2: Farnell; Supplier Part Number 2: 1563612; Supplier 3: Newark; Supplier Part Number 3: 72M6832
R28 = CRCW060333K0JNEA: RES, 33k ohm, 5%, 0.1W, 0603; Manufacturer: Vishay-Dale; CompType: Resistor; Res_ohm: 33000; Value_Code: 33k0; Tolerance_%: 5; Power_W: 0.1; VDC_V: 75; TempCo: 200 ppm/C; EIA_Code: E24; U/M: EA; SymbolVersion: 2009-05-29; PartNumber: CRCW060333K0JNEA; PackageReference: 0603; RoHS: Y; Value1: 5%; Value2: 0.1W; MountType: SMT; Technology: Thick Film; Published: 2008-06-26; Publisher: Texas Instruments; LatestRevisionDate: 2014-05-20; ComponentLink1Description: Datasheet link; ComponentLink1URL: http://www.vishay.com/docs/20035/dcrcwe3.pdf; Supplier 1: Digi-Key; Supplier Part Number 1: 541-33KGCT-ND; Supplier 2: Farnell; Supplier Part Number 2: 1514756; Supplier 3: Newark; Supplier Part Number 3: 59M6802
R30 = CRCW06037K50JNEA: RES, 7.5 k, 5%, 0.1 W, 0603; Manufacturer: Vishay-Dale; CompType: Resistor; Value: 7.5k; Res_ohm: 7500; Value_Code: 7k50; Tolerance_%: 5; Power_W: 0.1; Value2: 0.1W; VDC_V: 75; TempCo: 200 ppm/C; EIA_Code: E24; U/M: EA; SymbolVersion: 2009-05-29; PartNumber: CRCW06037K50JNEA; PackageReference: 0603; RoHS: Y; Value1: 5%; MountType: SMT; Technology: Thick Film; Published: 2008-06-26; Publisher: Texas Instruments; LatestRevisionDate: 2014-12-01; ComponentLink1Description: Datasheet link; ComponentLink1URL: http://www.vishay.com/docs/20035/dcrcwe3.pdf; Supplier 1: Digi-Key; Supplier Part Number 1: 541-7.5KGCT-ND; Supplier 2: Mouser; Supplier Part Number 2: 71-CRCW0603J-7.5K-E3; Supplier 3: Farnell; Supplier Part Number 3: 1514789
R31 = CRCW060310K0JNEA: RES, 10 k, 5%, 0.1 W, 0603; Manufacturer: Vishay-Dale; CompType: Resistor; Value: 10k; Res_ohm: 10000; Value_Code: 10k0; Tolerance_%: 5; Power_W: 0.1; Value2: 0.1W; VDC_V: 75; TempCo: 200 ppm/C; EIA_Code: E24; U/M: EA; SymbolVersion: 2009-05-29; PartNumber: CRCW060310K0JNEA; PackageReference: 0603; RoHS: Y; Value1: 5%; MountType: SMT; Technology: Thick Film; Published: 2008-06-26; Publisher: Texas Instruments; LatestRevisionDate: 2014-12-01; ComponentLink1Description: Datasheet link; ComponentLink1URL: http://www.vishay.com/docs/20035/dcrcwe3.pdf; Supplier 1: Digi-Key; Supplier Part Number 1: 541-10KGCT-ND; Supplier 2: Mouser; Supplier Part Number 2: 71-CRCW0603J-10K-E3; Supplier 3: Farnell; Supplier Part Number 3: 1469749
S1 = 4-1437565-1: Switch, Tactile, SPST-NO, 0.05A, 12V, SMT; Manufacturer: TE Connectivity; SymbolCreator: a0412235; VDC_V: 12; SwitchFunction: Off-Mom; PositionCount: 1; CurrentRating_mA: 50; SymbolVersion: 2013-06-27; PartNumber: 4-1437565-1; MountType: SMT; ComponentLink1Description: Datasheet URL; ComponentLink1URL: http://www.te.com/commerce/DocumentDelivery/DDEController?Action=showdoc&DocId=Customer+Drawing%7F2-1437565-7%7FU2%7Fpdf%7FEnglish%7FENG_CD_2-1437565-7_U2.pdf%7F4-1437565-1; RoHS: Y; Circuit: SPST-NO; Orientation: Top Actuated; CompType: Switch; PackageReference: SW, SPST 6x6 mm; Publisher: Texas Instruments; LatestRevisionDate: 2013-11-21; Supplier 1: Digi-Key; Supplier Part Number 1: 450-1129-ND; Supplier 2: Mouser; Supplier Part Number 2: 506-FSM4JSMA
SH-J1 SH-J2 = 969102-0000-DA: Shunt, 100mil, Gold plated, Black; Manufacturer: 3M; Alternate Manufacturer: Samtec; Value: 1x2; Note: You can "mate" this to a header by matching the designator.  i.e. use SH-J3 for header J3; ClassName: Shunt; CompType: Shunt; PartNumber: 969102-0000-DA; RoHS: Y; PackageReference: Shunt; MountType: N/A; ComponentLink1Description: Datasheet Link; ComponentLink1URL: http://multimedia.3m.com/mws/mediawebserver?66666UuZjcFSLXTtNxTElXf6EVuQEcuZgVs6EVs6E666666--; Publisher: Texas Instruments; LatestRevisionDate: 2013-12-09; Alternate PartNumber: SNT-100-BK-G; Supplier 1: Digi-Key; Supplier Part Number 1: 3M9580-ND; Supplier 2: Mouser; Supplier Part Number 2: 517-9691020000DA
TP1-TP3 = 5005: Test Point, Compact, Red, TH; Manufacturer: Keystone; CompType: Test Point Loop; U/M: EA; SymbolVersion: 2008-04-04; PartNumber: 5005; Value: Red; PackageReference: Red Compact Testpoint; RoHS: Y; MountType: TH; ComponentLink1Description: Datasheet Link; ComponentLink1URL: http://www.keyelco.com/userAssets/file/M60-2p60.pdf; Publisher: Texas Instruments; LatestRevisionDate: 2013-12-17; Supplier 1: Digi-Key; Supplier Part Number 1: 5005K-ND
TP4 TP12 TP19 = 5006: Test Point, Compact, Black, TH; Manufacturer: Keystone; CompType: Test Point Loop; U/M: EA; SymbolVersion: 2008-04-04; PartNumber: 5006; Value: Black; PackageReference: Black Compact Testpoint; RoHS: Y; MountType: TH; ComponentLink1Description: Datasheet Link; ComponentLink1URL: http://www.keyelco.com/userAssets/file/M60-2p60.pdf; Publisher: Texas Instruments; LatestRevisionDate: 2013-09-12; Supplier 1: Digi-Key; Supplier Part Number 1: 5006K-ND
TP5-TP10 = 5007: Test Point, Compact, White, TH; Manufacturer: Keystone; CompType: Test Point Loop; U/M: EA; SymbolVersion: 2008-04-04; PartNumber: 5007; Value: White; PackageReference: White Compact Testpoint; RoHS: Y; MountType: TH; ComponentLink1Description: Datasheet Link; ComponentLink1URL: http://www.keyelco.com/userAssets/file/M60-2p60.pdf; Publisher: Texas Instruments; LatestRevisionDate: 2013-09-12; Supplier 1: Digi-Key; Supplier Part Number 1: 5007K-ND
TP11 TP13 TP15 TP16 TP20-TP23 = TESTPOINT: TEST POINT.  No entry in BOM.; SymbolVersion: 2010-10-20; CompType: Testpoint; Publisher: Texas Instruments; LatestRevisionNote: Added Alternate PartNumber and Alternate Manufacturer parameters to appropriate components.
  TP11 TP13 TP15 TP16: LatestRevisionDate: 2013-12-05
  TP20-TP23: PackageReference: N/A; LatestRevisionDate: 2014-10-27
TP14 = D3082-05: 1mm Uninsulated Shorting Plug, 10.16mm spacing, TH; Manufacturer: Harwin; SymbolCreator: a0799628; CompType: Jumper Wire; U/M: EA; SymbolVersion: 2014-05-16; PartNumber: D3082-05; PackageReference: Shorting Plug, 10.16mm spacing, TH; RoHS: Y; MountType: TH; ComponentLink1Description: Datasheet Link; ComponentLink1URL: http://cdn.harwin.com/pdfs/D3080-D3083.pdf; Publisher: Texas Instruments; LatestRevisionDate: 2015-02-10; Supplier 1: Digi-Key; Supplier Part Number 1: 952-1873-ND; Supplier 2: Mouser; Supplier Part Number 2: 855-D3082-05
U1 = DRV8701ERGER: H-Bridge Gate Driver, RGE0024F; Alternate PartNumber: DRV8701ERGET; Manufacturer: Texas Instruments; SymbolCreator: Altium; CompType: IC; U/M: EA; SymbolVersion: 2015-02-10; PartNumber: DRV8701ERGER; PackageReference: RGE0024F; MountType: SMT; ComponentLink1Description: Datasheet Link; ComponentLink1URL: https://sps06.itg.ti.com/sites/KMS/crossdivteams/altium/docs/ComponentDatasheets/DRV8701_011615.pdf; Publisher: Texas Instruments; LatestRevisionDate: 2015-02-10; Alternate Manufacturer: Texas Instruments
U2 = FT232RL: USB to Serial UART, SSOP28; Manufacturer: FTDI; SymbolCreator: x0208326; SymbolVersion: 2014-03-03; PartNumber: FT232RL; MountType: SMT; ComponentLink1Description: Datasheet Link; ComponentLink1URL: http://www.ftdichip.com/Support/Documents/DataSheets/ICs/DS_FT232R.pdf; RoHS: Y; PackageReference: SSOP28; Publisher: Texas Instruments; LatestRevisionDate: 2015-02-02; Supplier 1: Digi-Key; Supplier Part Number 1: 768-1007-1-ND; Supplier 2: Mouser; Supplier Part Number 2: 895-FT232RL; Supplier 3: Farnell; Supplier Part Number 3: 1146032
U3 = MSP430G2553IPW20: 16 MHz Mixed Signal Microcontroller with 16 KB Flash, 512 B SRAM and 24 GPIOs, -40 to 85 degC, 20-pin SOP (PW), Green (RoHS & no Sb/Br); Alternate Manufacturer: Texas Instruments; Alternate PartNumber: Equivalent; ADC: 10-bit SAR; ADC Channels: 8; Brown Out Reset: Yes; Flash(KB): 16; GPIO: 24; Pin/Package: 0DIESALE, 0WAFERSALE, 20PDIP, 20TSSOP, 28TSSOP, 32QFN; SRAM(B): 512; SubFamily: Value Line; Timers - 16-bit: 2; USCI_A (UART/LIN/IrDA/SPI): 1; DatasheetVersion: SLAS735G; PackageVersion: 4040064-5/G, 02/2011; PackageReference: PW0020A; PackageDescription: 20-Pin Plastic Small Outline, Body 6.5 x 4.4 mm, Pitch 0.65 mm; Cap touch I/O: Yes; Comparators: Yes; Eco-Plan: Green (RoHS & no Sb/Br); Frequency(MHz): 16; Temp Sensor: Yes; USCI_B (I2C & SPI): 1; Watchdog: Yes; MountType: SMT; Code_JEDEC: MO-153; ComponentLink1Description: Manufacturer URL; ComponentLink1URL: http://www.ti.com/; ComponentLink2Description: Datasheet; ComponentLink2URL: http://www.ti.com/general/docs/lit/getliterature.tsp?genericPartNumber=MSP430G2553&fileType=pdf; PartNumber: MSP430G2553IPW20; Manufacturer: Texas Instruments